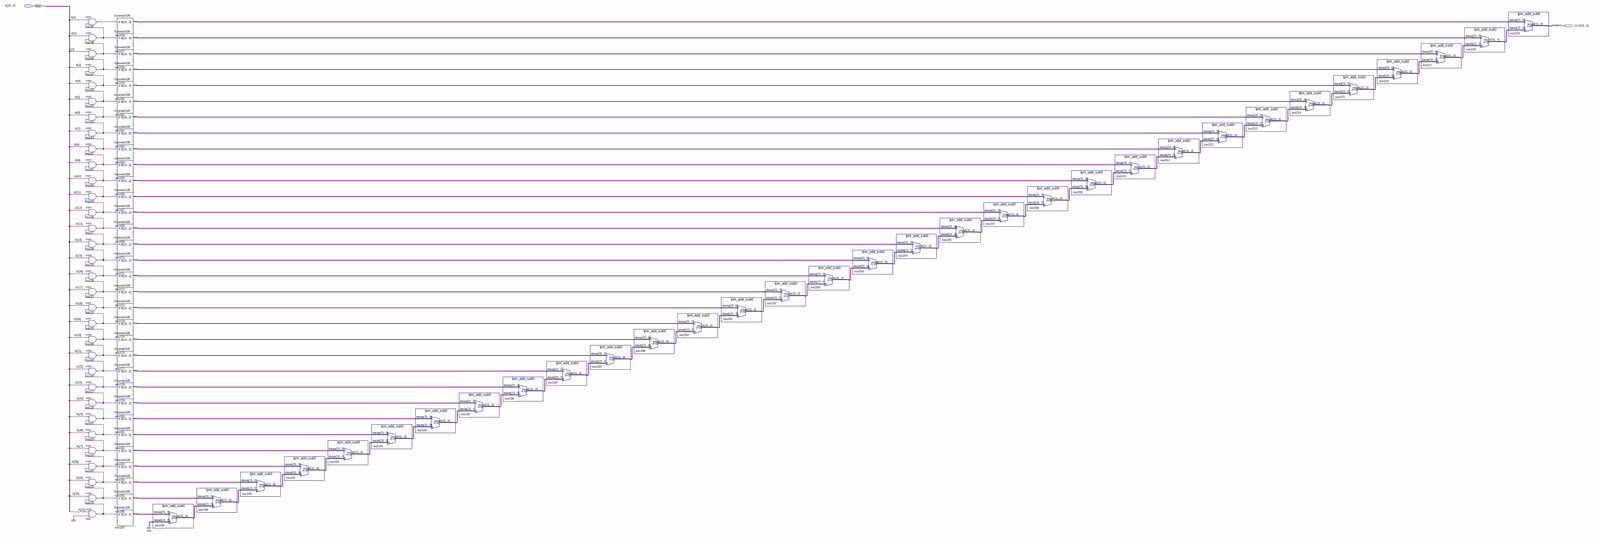
[diagram p0: schematic sheet, whole]
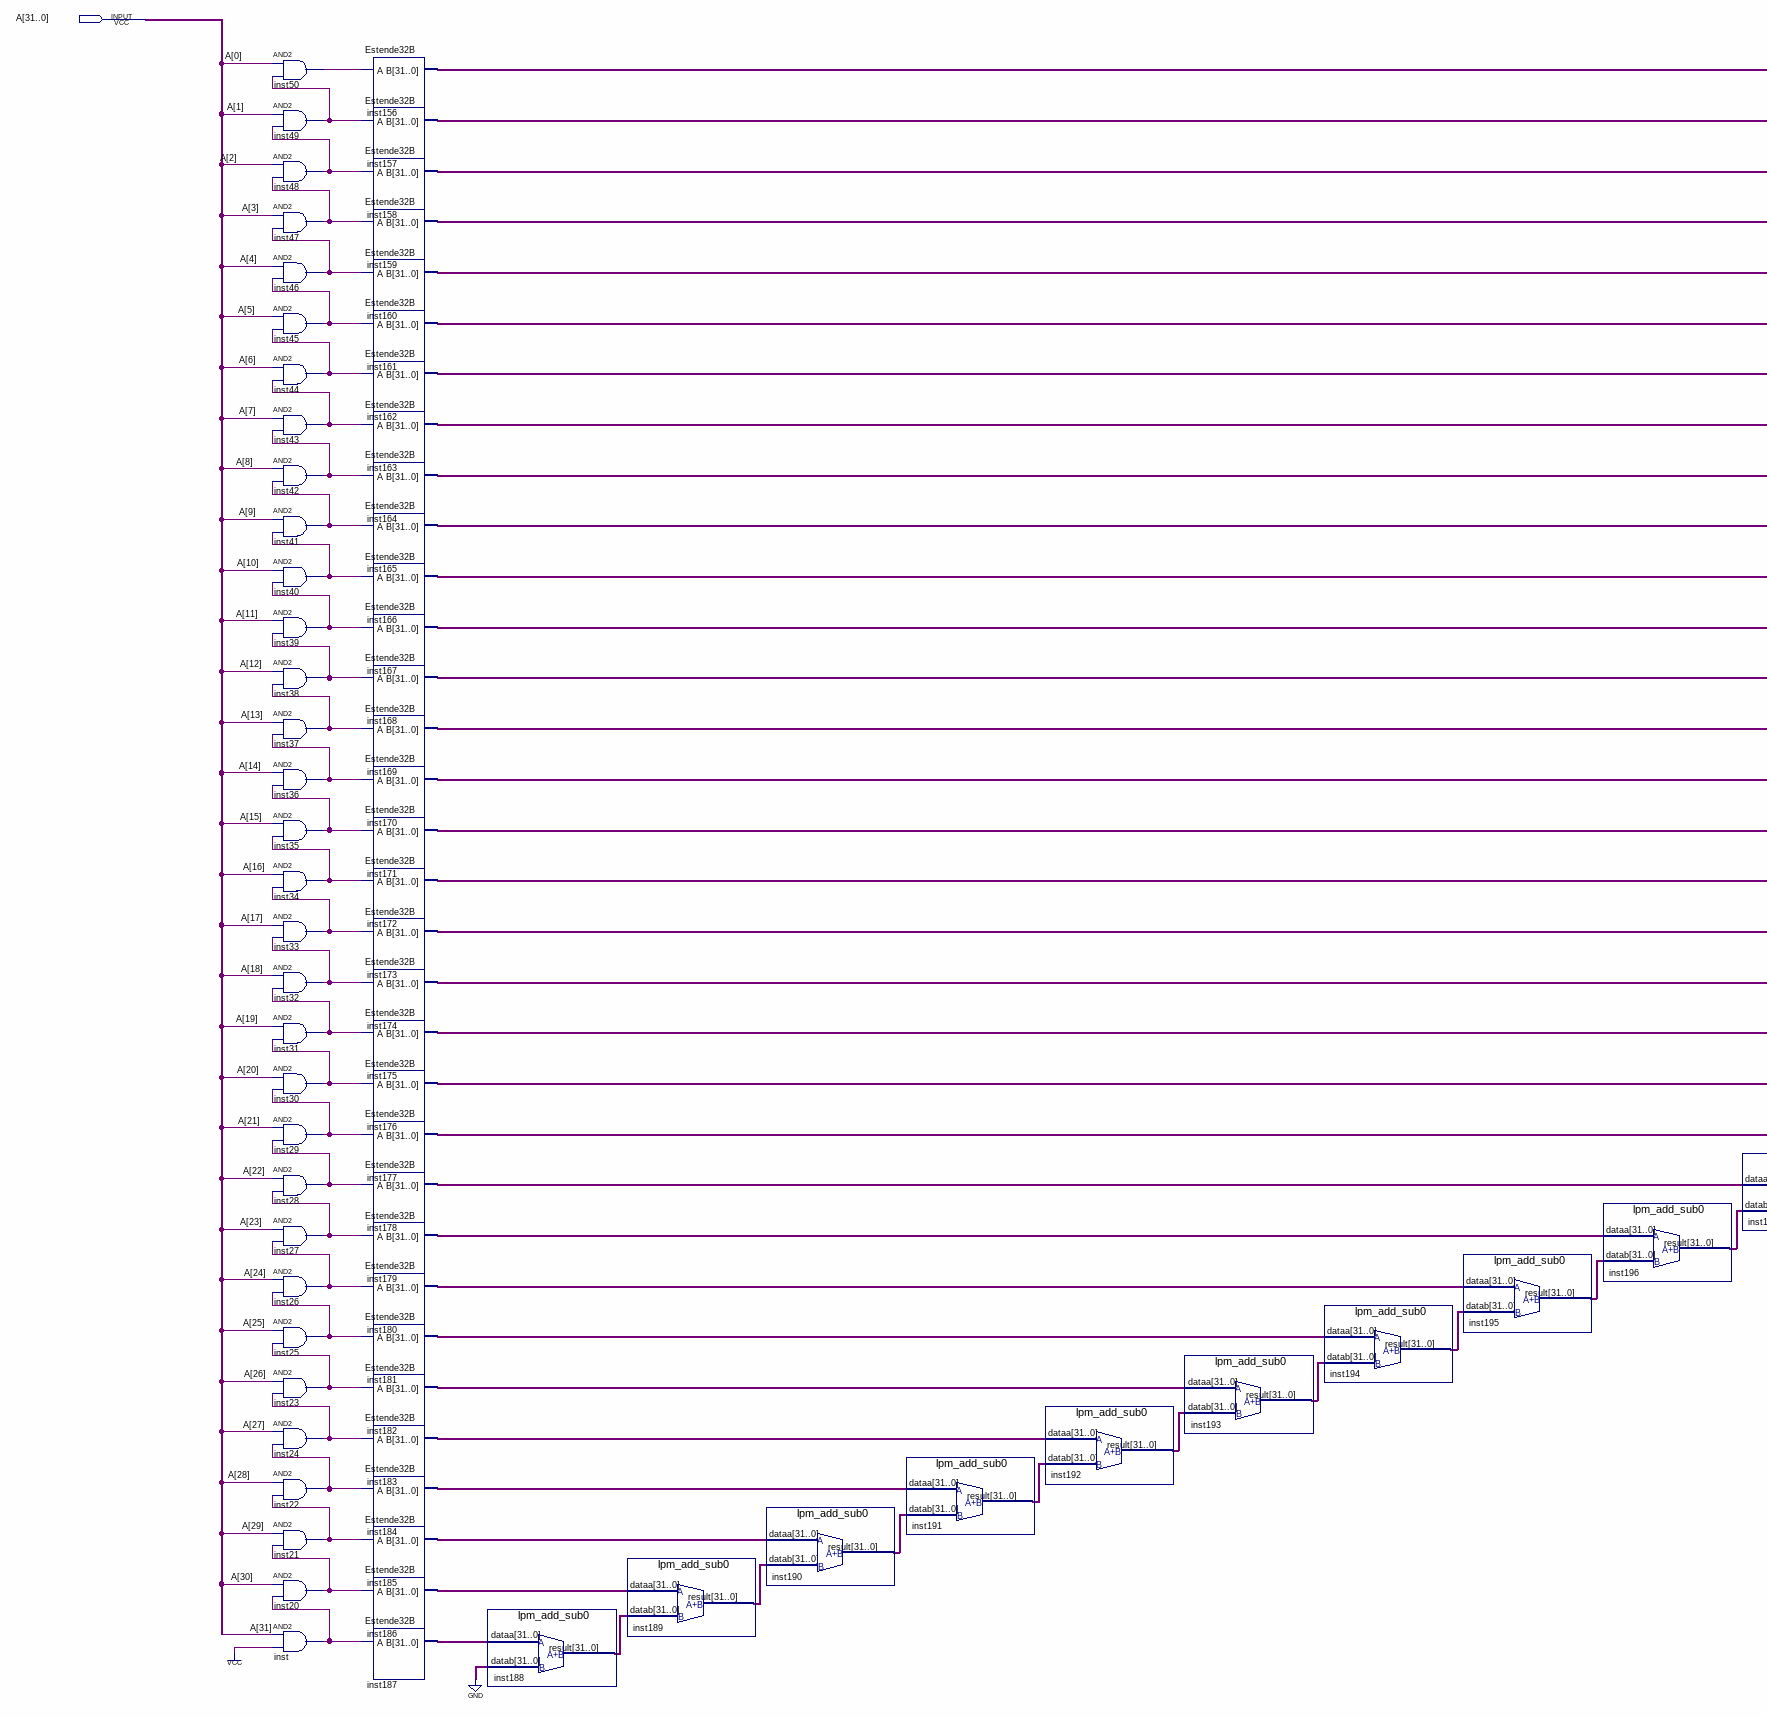
[diagram p1: schematic sheet, left part]
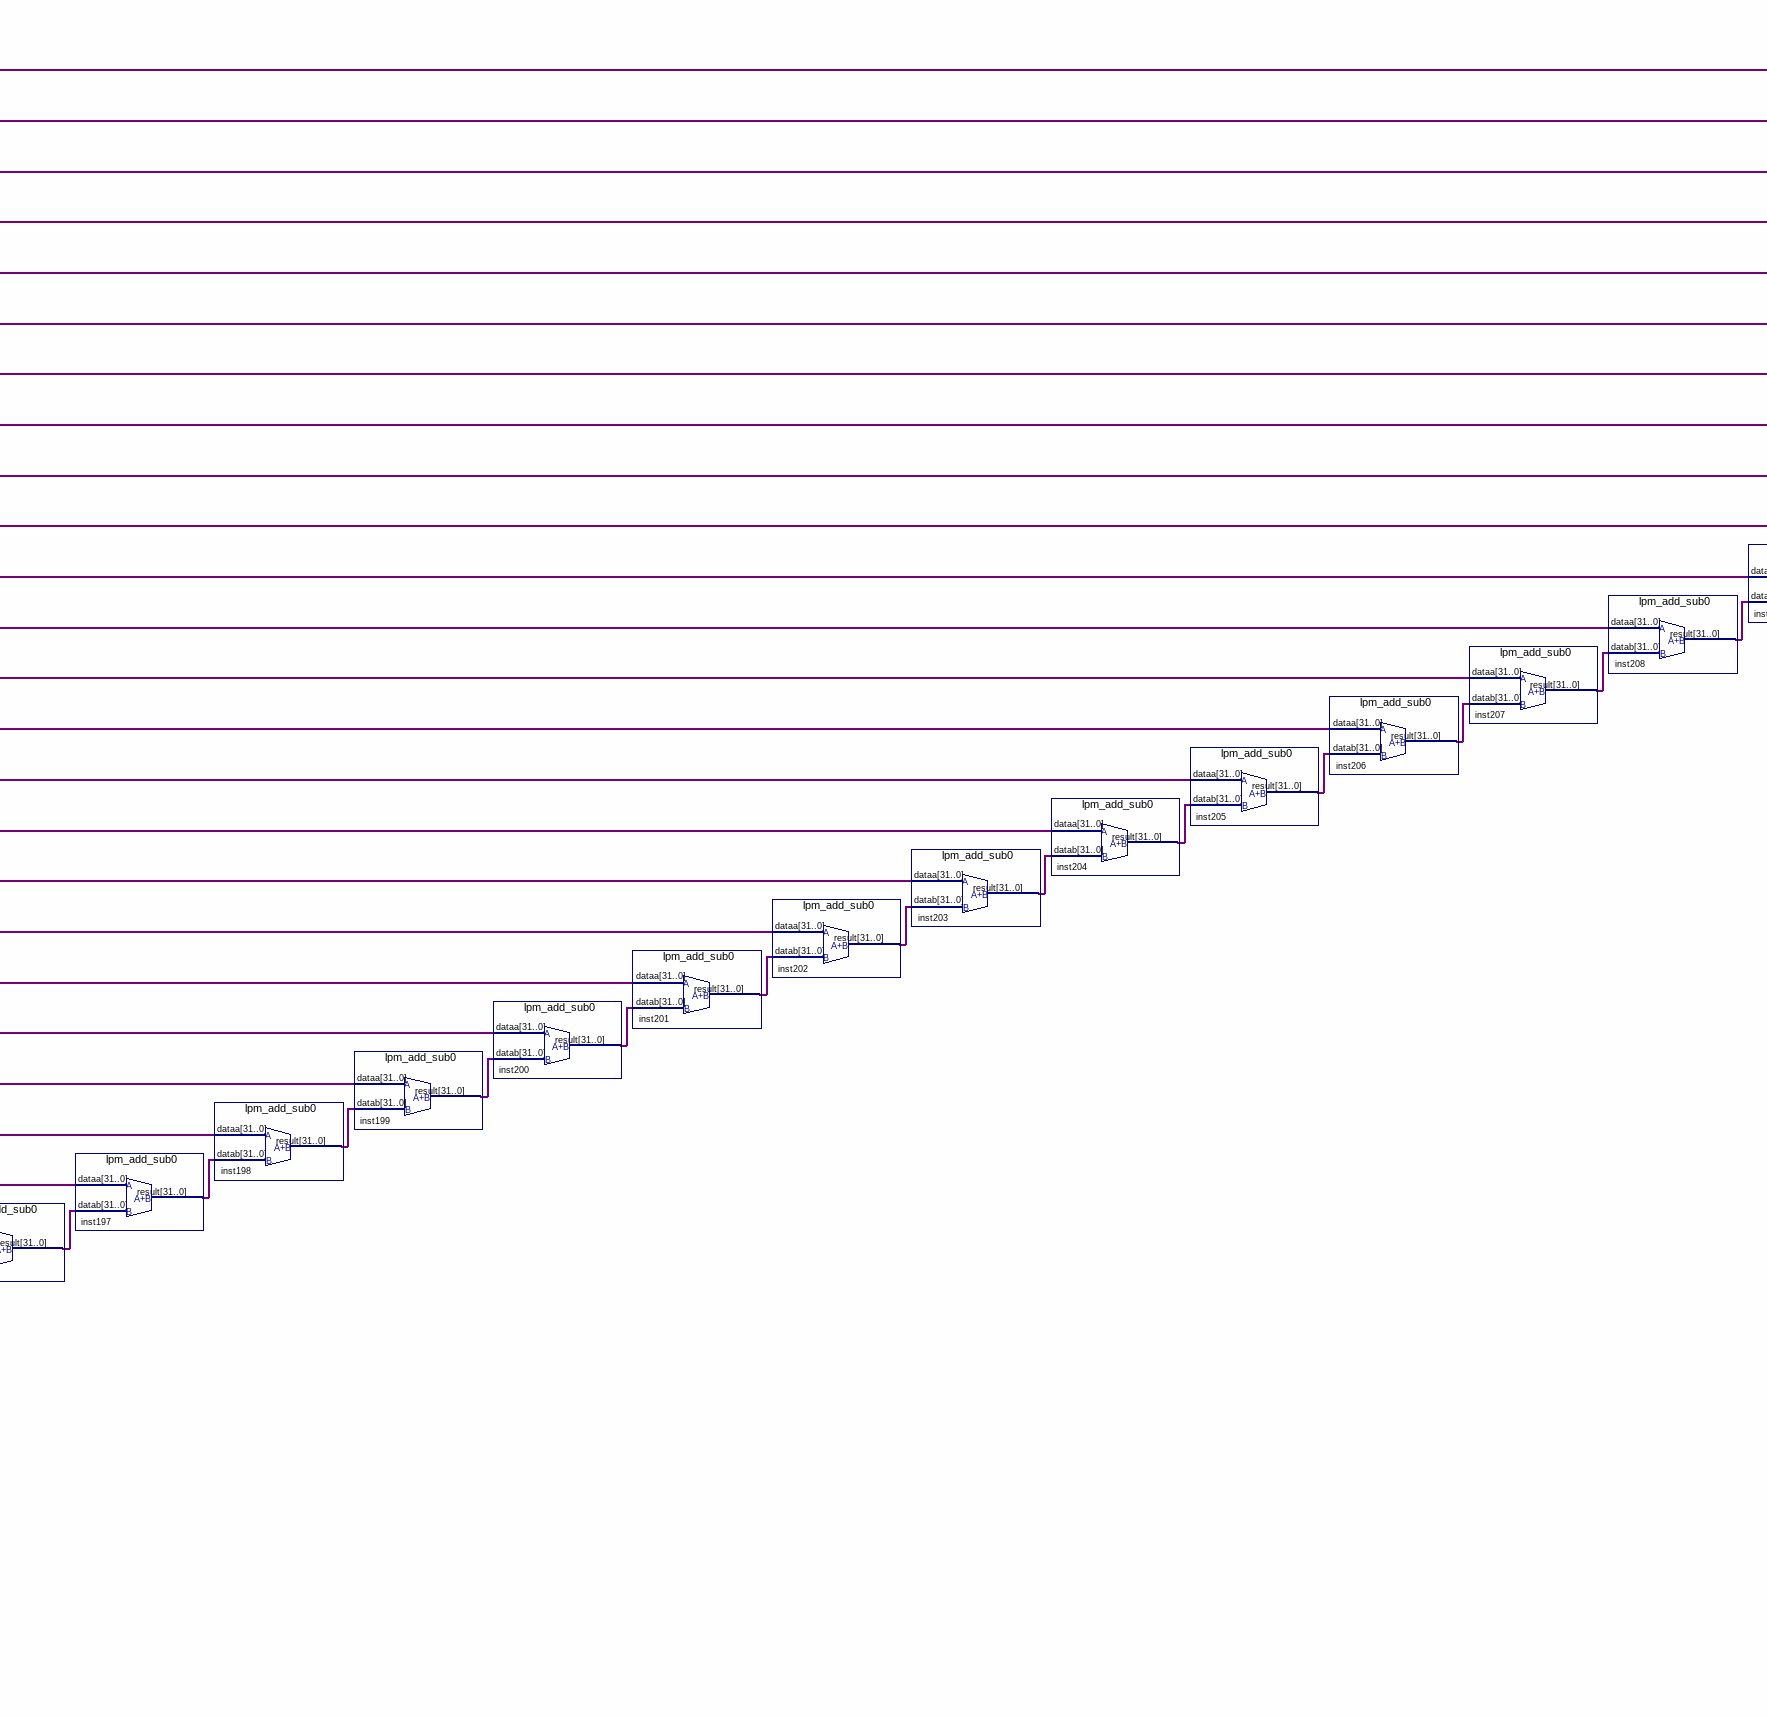
[diagram p2: schematic sheet, centre part]
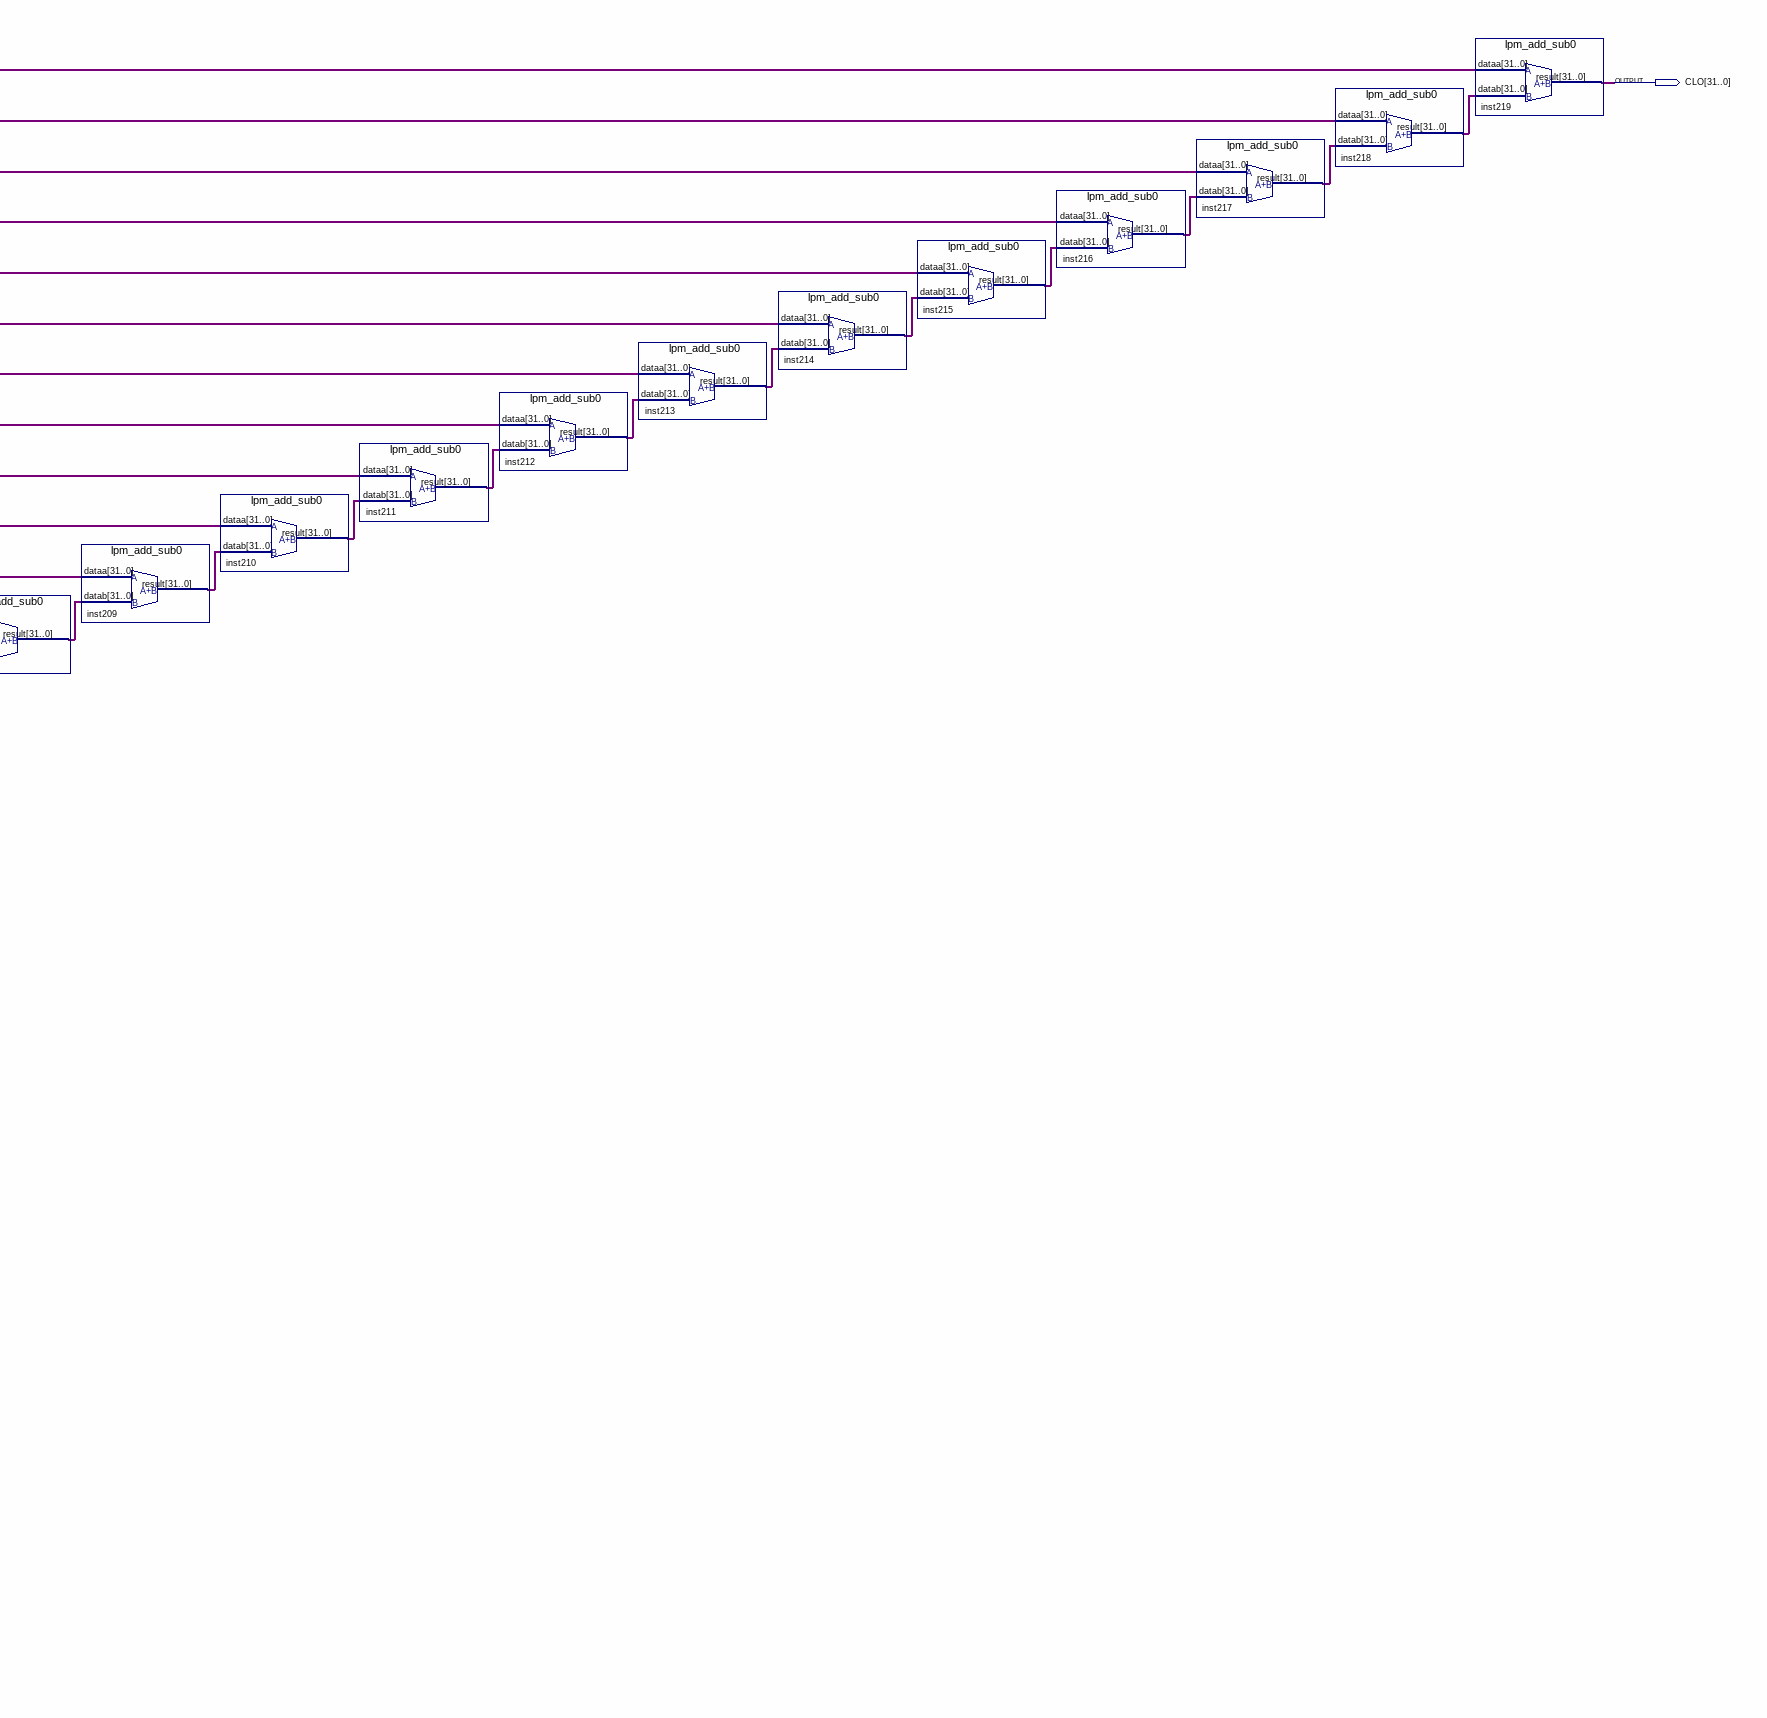
[diagram p3: schematic sheet, right part]
// Quartus schematic CLO.bdf as structural Verilog: 96 symbols, 2 pins
module CLO (
  input  [31:0] A,
  output [31:0] CLO
);

  wire inst20_out, inst21_out, inst22_out, inst23_out, inst24_out, inst25_out, inst26_out, inst27_out,
       inst28_out, inst29_out, inst30_out, inst31_out, inst32_out, inst33_out, inst34_out, inst35_out,
       inst36_out, inst37_out, inst38_out, inst39_out, inst40_out, inst41_out, inst42_out, inst43_out,
       inst44_out, inst45_out, inst46_out, inst47_out, inst48_out, inst49_out, inst50_out, inst_out;
  wire [31:0] inst156_b, inst157_b, inst158_b, inst159_b, inst160_b, inst161_b, inst162_b, inst163_b,
       inst164_b, inst165_b, inst166_b, inst167_b, inst168_b, inst169_b, inst170_b, inst171_b, inst172_b,
       inst173_b, inst174_b, inst175_b, inst176_b, inst177_b, inst178_b, inst179_b, inst180_b, inst181_b,
       inst182_b, inst183_b, inst184_b, inst185_b, inst186_b, inst187_b, inst188_result, inst189_result,
       inst190_result, inst191_result, inst192_result, inst193_result, inst194_result, inst195_result,
       inst196_result, inst197_result, inst198_result, inst199_result, inst200_result, inst201_result,
       inst202_result, inst203_result, inst204_result, inst205_result, inst206_result, inst207_result,
       inst208_result, inst209_result, inst210_result, inst211_result, inst212_result, inst213_result,
       inst214_result, inst215_result, inst216_result, inst217_result, inst218_result;

  and inst50 (inst50_out, A[0], inst49_out);
  and inst49 (inst49_out, A[1], inst48_out);
  and inst48 (inst48_out, A[2], inst47_out);
  and inst47 (inst47_out, A[3], inst46_out);
  and inst46 (inst46_out, A[4], inst45_out);
  and inst45 (inst45_out, A[5], inst44_out);
  and inst44 (inst44_out, A[6], inst43_out);
  and inst43 (inst43_out, A[7], inst42_out);
  and inst42 (inst42_out, A[8], inst41_out);
  and inst41 (inst41_out, A[9], inst40_out);
  and inst40 (inst40_out, A[10], inst39_out);
  and inst39 (inst39_out, A[11], inst38_out);
  and inst38 (inst38_out, A[12], inst37_out);
  and inst37 (inst37_out, A[13], inst36_out);
  and inst36 (inst36_out, A[14], inst35_out);
  and inst35 (inst35_out, A[15], inst34_out);
  and inst34 (inst34_out, A[16], inst33_out);
  and inst33 (inst33_out, A[17], inst32_out);
  and inst32 (inst32_out, A[18], inst31_out);
  and inst31 (inst31_out, A[19], inst30_out);
  and inst30 (inst30_out, A[20], inst29_out);
  and inst29 (inst29_out, A[21], inst28_out);
  and inst28 (inst28_out, A[22], inst27_out);
  and inst27 (inst27_out, A[23], inst26_out);
  and inst26 (inst26_out, A[24], inst25_out);
  and inst25 (inst25_out, A[25], inst23_out);
  and inst23 (inst23_out, A[26], inst24_out);
  and inst24 (inst24_out, A[27], inst22_out);
  and inst22 (inst22_out, A[28], inst21_out);
  and inst21 (inst21_out, A[29], inst20_out);
  and inst20 (inst20_out, A[30], inst_out);
  and inst (inst_out, A[31], 1'b1);
  Estende32B inst156 (.A(inst50_out), .B(inst156_b));
  Estende32B inst157 (.A(inst49_out), .B(inst157_b));
  Estende32B inst158 (.A(inst48_out), .B(inst158_b));
  Estende32B inst159 (.A(inst47_out), .B(inst159_b));
  Estende32B inst160 (.A(inst46_out), .B(inst160_b));
  Estende32B inst161 (.A(inst45_out), .B(inst161_b));
  Estende32B inst162 (.A(inst44_out), .B(inst162_b));
  Estende32B inst163 (.A(inst43_out), .B(inst163_b));
  Estende32B inst164 (.A(inst42_out), .B(inst164_b));
  Estende32B inst165 (.A(inst41_out), .B(inst165_b));
  Estende32B inst166 (.A(inst40_out), .B(inst166_b));
  Estende32B inst167 (.A(inst39_out), .B(inst167_b));
  Estende32B inst168 (.A(inst38_out), .B(inst168_b));
  Estende32B inst169 (.A(inst37_out), .B(inst169_b));
  Estende32B inst170 (.A(inst36_out), .B(inst170_b));
  Estende32B inst171 (.A(inst35_out), .B(inst171_b));
  Estende32B inst172 (.A(inst34_out), .B(inst172_b));
  Estende32B inst173 (.A(inst33_out), .B(inst173_b));
  Estende32B inst174 (.A(inst32_out), .B(inst174_b));
  Estende32B inst175 (.A(inst31_out), .B(inst175_b));
  Estende32B inst176 (.A(inst30_out), .B(inst176_b));
  Estende32B inst177 (.A(inst29_out), .B(inst177_b));
  Estende32B inst178 (.A(inst28_out), .B(inst178_b));
  Estende32B inst179 (.A(inst27_out), .B(inst179_b));
  Estende32B inst180 (.A(inst26_out), .B(inst180_b));
  Estende32B inst181 (.A(inst25_out), .B(inst181_b));
  Estende32B inst182 (.A(inst23_out), .B(inst182_b));
  Estende32B inst183 (.A(inst24_out), .B(inst183_b));
  Estende32B inst184 (.A(inst22_out), .B(inst184_b));
  Estende32B inst185 (.A(inst21_out), .B(inst185_b));
  Estende32B inst186 (.A(inst20_out), .B(inst186_b));
  Estende32B inst187 (.A(inst_out), .B(inst187_b));
  lpm_add_sub0 inst188 (.dataa(inst187_b), .datab({32{1'b0}}), .result(inst188_result));
  lpm_add_sub0 inst189 (.dataa(inst186_b), .datab(inst188_result), .result(inst189_result));
  lpm_add_sub0 inst190 (.dataa(inst185_b), .datab(inst189_result), .result(inst190_result));
  lpm_add_sub0 inst191 (.dataa(inst184_b), .datab(inst190_result), .result(inst191_result));
  lpm_add_sub0 inst192 (.dataa(inst183_b), .datab(inst191_result), .result(inst192_result));
  lpm_add_sub0 inst193 (.dataa(inst182_b), .datab(inst192_result), .result(inst193_result));
  lpm_add_sub0 inst194 (.dataa(inst181_b), .datab(inst193_result), .result(inst194_result));
  lpm_add_sub0 inst195 (.dataa(inst180_b), .datab(inst194_result), .result(inst195_result));
  lpm_add_sub0 inst196 (.dataa(inst179_b), .datab(inst195_result), .result(inst196_result));
  lpm_add_sub0 inst197 (.dataa(inst178_b), .datab(inst196_result), .result(inst197_result));
  lpm_add_sub0 inst198 (.dataa(inst177_b), .datab(inst197_result), .result(inst198_result));
  lpm_add_sub0 inst199 (.dataa(inst176_b), .datab(inst198_result), .result(inst199_result));
  lpm_add_sub0 inst200 (.dataa(inst175_b), .datab(inst199_result), .result(inst200_result));
  lpm_add_sub0 inst201 (.dataa(inst174_b), .datab(inst200_result), .result(inst201_result));
  lpm_add_sub0 inst202 (.dataa(inst173_b), .datab(inst201_result), .result(inst202_result));
  lpm_add_sub0 inst203 (.dataa(inst172_b), .datab(inst202_result), .result(inst203_result));
  lpm_add_sub0 inst204 (.dataa(inst171_b), .datab(inst203_result), .result(inst204_result));
  lpm_add_sub0 inst205 (.dataa(inst170_b), .datab(inst204_result), .result(inst205_result));
  lpm_add_sub0 inst206 (.dataa(inst169_b), .datab(inst205_result), .result(inst206_result));
  lpm_add_sub0 inst207 (.dataa(inst168_b), .datab(inst206_result), .result(inst207_result));
  lpm_add_sub0 inst208 (.dataa(inst167_b), .datab(inst207_result), .result(inst208_result));
  lpm_add_sub0 inst209 (.dataa(inst166_b), .datab(inst208_result), .result(inst209_result));
  lpm_add_sub0 inst210 (.dataa(inst165_b), .datab(inst209_result), .result(inst210_result));
  lpm_add_sub0 inst211 (.dataa(inst164_b), .datab(inst210_result), .result(inst211_result));
  lpm_add_sub0 inst212 (.dataa(inst163_b), .datab(inst211_result), .result(inst212_result));
  lpm_add_sub0 inst213 (.dataa(inst162_b), .datab(inst212_result), .result(inst213_result));
  lpm_add_sub0 inst214 (.dataa(inst161_b), .datab(inst213_result), .result(inst214_result));
  lpm_add_sub0 inst215 (.dataa(inst160_b), .datab(inst214_result), .result(inst215_result));
  lpm_add_sub0 inst216 (.dataa(inst159_b), .datab(inst215_result), .result(inst216_result));
  lpm_add_sub0 inst217 (.dataa(inst158_b), .datab(inst216_result), .result(inst217_result));
  lpm_add_sub0 inst218 (.dataa(inst157_b), .datab(inst217_result), .result(inst218_result));
  lpm_add_sub0 inst219 (.dataa(inst156_b), .datab(inst218_result), .result(CLO));
endmodule
